# Altium schematic sheet Keyboard_KEYS.SchDoc
size A4
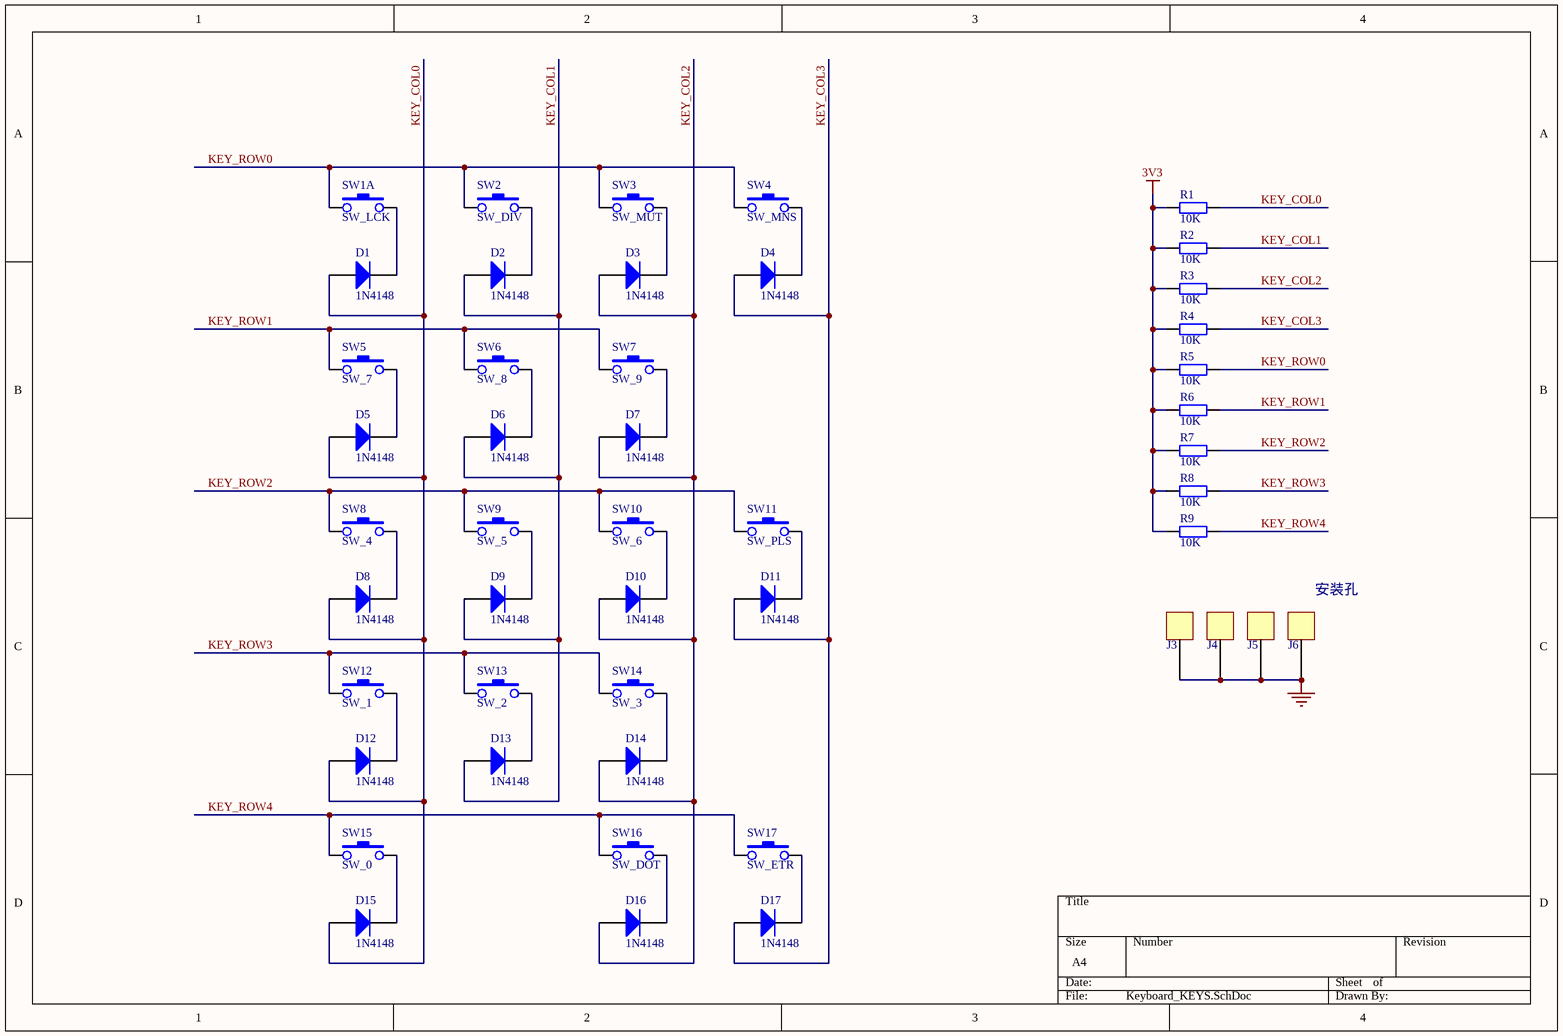
[diagram p0: Keyboard_KEYS.SchDoc]

## Parts
D1  1N4148  [SOD80]
D2  1N4148  [SOD80]
D3  1N4148  [SOD80]
D4  1N4148  [SOD80]
D5  1N4148  [SOD80]
D6  1N4148  [SOD80]
D7  1N4148  [SOD80]
D8  1N4148  [SOD80]
D9  1N4148  [SOD80]
D10  1N4148  [SOD80]
D11  1N4148  [SOD80]
D12  1N4148  [SOD80]
D13  1N4148  [SOD80]
D14  1N4148  [SOD80]
D15  1N4148  [SOD80]
D16  1N4148  [SOD80]
D17  1N4148  [SOD80]
J3  Hole  [PADR3/4]  (value not drawn)
J4  Hole  [PADR3/4]  (value not drawn)
J5  Hole  [PADR3/4]  (value not drawn)
J6  Hole  [PADR3/4]  (value not drawn)
R1  10K  [R0603]
R2  10K  [R0603]
R3  10K  [R0603]
R4  10K  [R0603]
R5  10K  [R0603]
R6  10K  [R0603]
R7  10K  [R0603]
R8  10K  [R0603]
R9  10K  [R0603]
SW1  SW_LCK  [MX_SW-4-1206LED]  (part A of 2)
SW2  SW_DIV  [MX_SW-4]
SW3  SW_MUT  [MX_SW-4]
SW4  SW_MNS  [MX_SW-4]
SW5  SW_7  [MX_SW-4]
SW6  SW_8  [MX_SW-4]
SW7  SW_9  [MX_SW-4]
SW8  SW_4  [MX_SW-4]
SW9  SW_5  [MX_SW-4]
SW10  SW_6  [MX_SW-4]
SW11  SW_PLS  [MX_SW-4_1x2_r]
SW12  SW_1  [MX_SW-4]
SW13  SW_2  [MX_SW-4]
SW14  SW_3  [MX_SW-4]
SW15  SW_0  [MX_SW-4_1x2]
SW16  SW_DOT  [MX_SW-4]
SW17  SW_ETR  [MX_SW-4_1x2_r]

## Nets
3V3: R1.1 R2.1 R3.1 R4.1 R5.1 R6.1 R7.1 R8.1 R9.1
GND: J3.1 J4.1 J5.1 J6.1
KEY_COL0: D1.1(A) D5.1(A) D8.1(A) D12.1(A) D15.1(A) R1.2
KEY_COL1: D2.1(A) D6.1(A) D9.1(A) D13.1(A) R2.2
KEY_COL2: D3.1(A) D7.1(A) D10.1(A) D14.1(A) D16.1(A) R3.2
KEY_COL3: D4.1(A) D11.1(A) D17.1(A) R4.2
KEY_ROW0: R5.2 SW1.1 SW2.1 SW3.1 SW4.1
KEY_ROW1: R6.2 SW5.1 SW6.1 SW7.1
KEY_ROW2: R7.2 SW8.1 SW9.1 SW10.1 SW11.1
KEY_ROW3: R8.2 SW12.1 SW13.1 SW14.1
KEY_ROW4: R9.2 SW15.1 SW16.1 SW17.1
NetD1_2: D1.2(K) SW1.2
NetD2_2: D2.2(K) SW2.2
NetD3_2: D3.2(K) SW3.2
NetD4_2: D4.2(K) SW4.2
NetD5_2: D5.2(K) SW5.2
NetD6_2: D6.2(K) SW6.2
NetD7_2: D7.2(K) SW7.2
NetD8_2: D8.2(K) SW8.2
NetD9_2: D9.2(K) SW9.2
NetD10_2: D10.2(K) SW10.2
NetD11_2: D11.2(K) SW11.2
NetD12_2: D12.2(K) SW12.2
NetD13_2: D13.2(K) SW13.2
NetD14_2: D14.2(K) SW14.2
NetD15_2: D15.2(K) SW15.2
NetD16_2: D16.2(K) SW16.2
NetD17_2: D17.2(K) SW17.2

## Notes on the sheet
- 安装孔

## Library data of the parts
D1-D17 = Diode: Default Diode
R1-R9 = Res2: Resistor; Value: 1K; Published: 8-Jun-2000; LatestRevisionDate: 17-Jul-2002; LatestRevisionNote: Re-released for DXP Platform.; PackageReference: AXIAL-0.4; Publisher: Altium Limited; PackageDescription: Axial Device, Thru-Hole; 2 Leads; 0.4 in Pin Spacing
SW1 = MX_SW-4-1206LED
SW2-SW17 = Push Buttom_2